# EAGLE schematic texasLDOv1 (EAGLE 7.1.0)
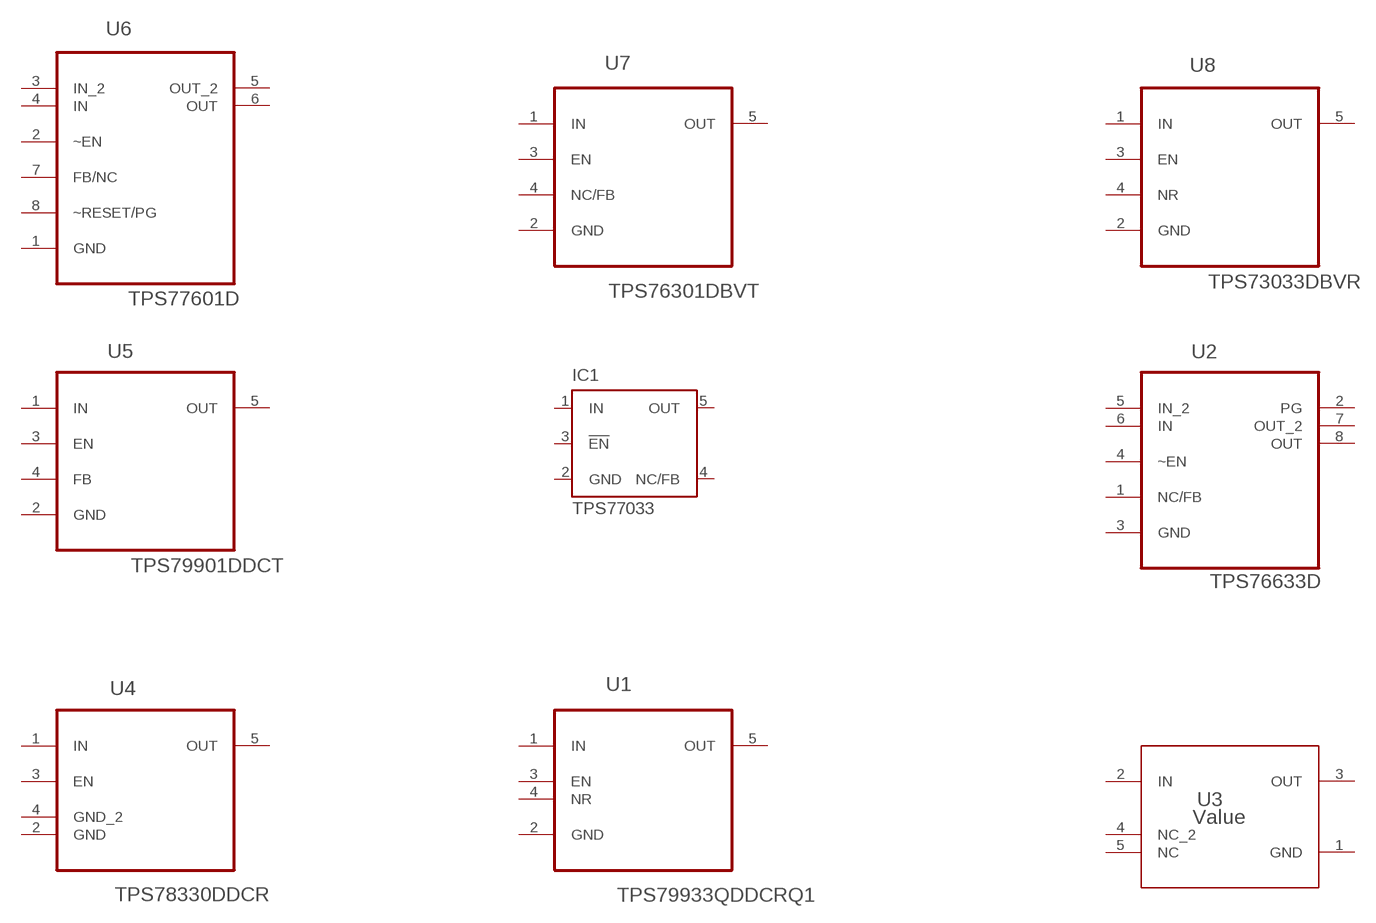
[diagram p0: schematic, sheet 1]

## Parts
IC1  TPS77033  [SOT23-DBV]
U1  TPS79933QDDCRQ1  [SOT95P280X110-5N]
U2  TPS76633D  [SOIC127P600X175-8N]
U3  Value  TLV70430DBVR  [DBV0005A_N]
U4  TPS78330DDCR  [SOT95P280X110-5N]
U5  TPS79901DDCT  [SOT95P280X110-5N]
U6  TPS77601D  [SOIC127P600X175-8N]
U7  TPS76301DBVT  [SOT95P280X145-5N]
U8  TPS73033DBVR  [SOT95P280X145-5N]
Unconnected: IC1.1(IN) IC1.3(!EN) IC1.4(NC/FB) IC1.5(OUT) U1.2(GND) U1.3(EN) U1.4(NR) U1.5(OUT) U2.1(NC/FB) U2.2(PG) U2.3(GND) U2.4(~EN) U2.5(IN_2) U2.6(IN) U2.7(OUT_2) U2.8(OUT) U3.4(NC_2) U3.5(NC) U4.1(IN) U4.2(GND) U4.3(EN) U4.4(GND_2) U4.5(OUT) U5.2(GND) U5.3(EN) U5.4(FB) U5.5(OUT) U6.1(GND) U6.2(~EN) U6.3(IN_2) U6.4(IN) U6.5(OUT_2) U6.6(OUT) U6.7(FB/NC) U6.8(~RESET/PG) U7.2(GND) U7.3(EN) U7.4(NC/FB) U7.5(OUT) U8.2(GND) U8.3(EN) U8.4(NR) U8.5(OUT)

## Power pins joined to a net without a drawn wire
GND: IC1.2(GND) U3.1(GND)
IN: U1.1(IN) U3.2(IN) U5.1(IN) U7.1(IN) U8.1(IN)
OUT: U3.3(OUT)

## Library data of the parts
IC1 = texas:TPS770*: ULTRALOW-POWER 50-mA LOW-DROPOUT LINEAR REGULATORS 50-mA Low-Dropout Regulator Source: http://focus.ti.com/lit/ds/symlink/tps77001.pdf; MF: TEXAS INSTRUMENTS; MPN: TPS77033DBVT; OC_FARNELL: 8461570; OC_NEWARK: 77C1187
U1 = Texas Instruments_By_element14_Batch_1:TPS79933QDDCRQ1: LINEAR REGULATOR; MPN: TPS79933QDDCRQ1; OC_FARNELL: -; OC_NEWARK: 25R0151; PACKAGE: SOT-5; SUPPLIER: Texas Instruments
U2 = Texas Instruments_By_element14_Batch_1:TPS76633D: ULTRALOW QUIESCENT CURRENT 250-mA LOW DROPOUT VOLTAGE REGULATORS; MPN: TPS76633D; OC_FARNELL: 8461422; OC_NEWARK: 77C1060; PACKAGE: SOIC-8; SUPPLIER: Texas Instruments
U3 = si5351:TLV70430DBVR; MANUFACTURER: Texas Instruments; PARTNUMBER: TLV70430DBVR; REFDES: RefDes; TYPE: TYPE
U4 = Texas Instruments_By_element14_Batch_1:TPS78330DDCR: 500nA IQ, 150mA, Ultra-Low Quiescent Current Low-Dropout Linear Regulator; MPN: TPS78330DDCR; OC_FARNELL: -; OC_NEWARK: 72R6681; PACKAGE: SOT-5; SUPPLIER: Texas Instruments
U5 = Texas Instruments_By_element14_Batch_1:TPS79901DDCT: 200mA, Low Quiescent Current, Ultra-Low Noise, High PSRR Low Dropout Linear Regulator; MPN: TPS79901DDCT; OC_FARNELL: 1135396; OC_NEWARK: 08K4978; PACKAGE: SOT-23-5; SUPPLIER: Texas Instruments
U6 = Texas Instruments_By_element14_Batch_1:TPS77601D: LINEAR REGULATORS; MPN: TPS77601D; OC_FARNELL: 4513411; OC_NEWARK: 19C9100; PACKAGE: SOIC-8; SUPPLIER: Texas Instruments
U7 = Texas Instruments_By_element14_Batch_1:TPS76301DBVT: Low power 150mA Low Dropout Linear Regulators; MPN: TPS76301DBVT; OC_FARNELL: 8461325; OC_NEWARK: 35K1346; PACKAGE: SOT-23-5; SUPPLIER: Texas Instruments
U8 = Texas Instruments_By_element14_Batch_1:TPS73033DBVR: LOW-NOISE, HIGH PSRR, RF 200-mA LOW-DROPOUT LINEAR REGULATORS; MPN: TPS73033DBVR; OC_FARNELL: 1696330; OC_NEWARK: 71J8232; PACKAGE: SOT-23-5; SUPPLIER: Texas Instruments